# Altium project 2011 Tilt Sensor.PrjPcb
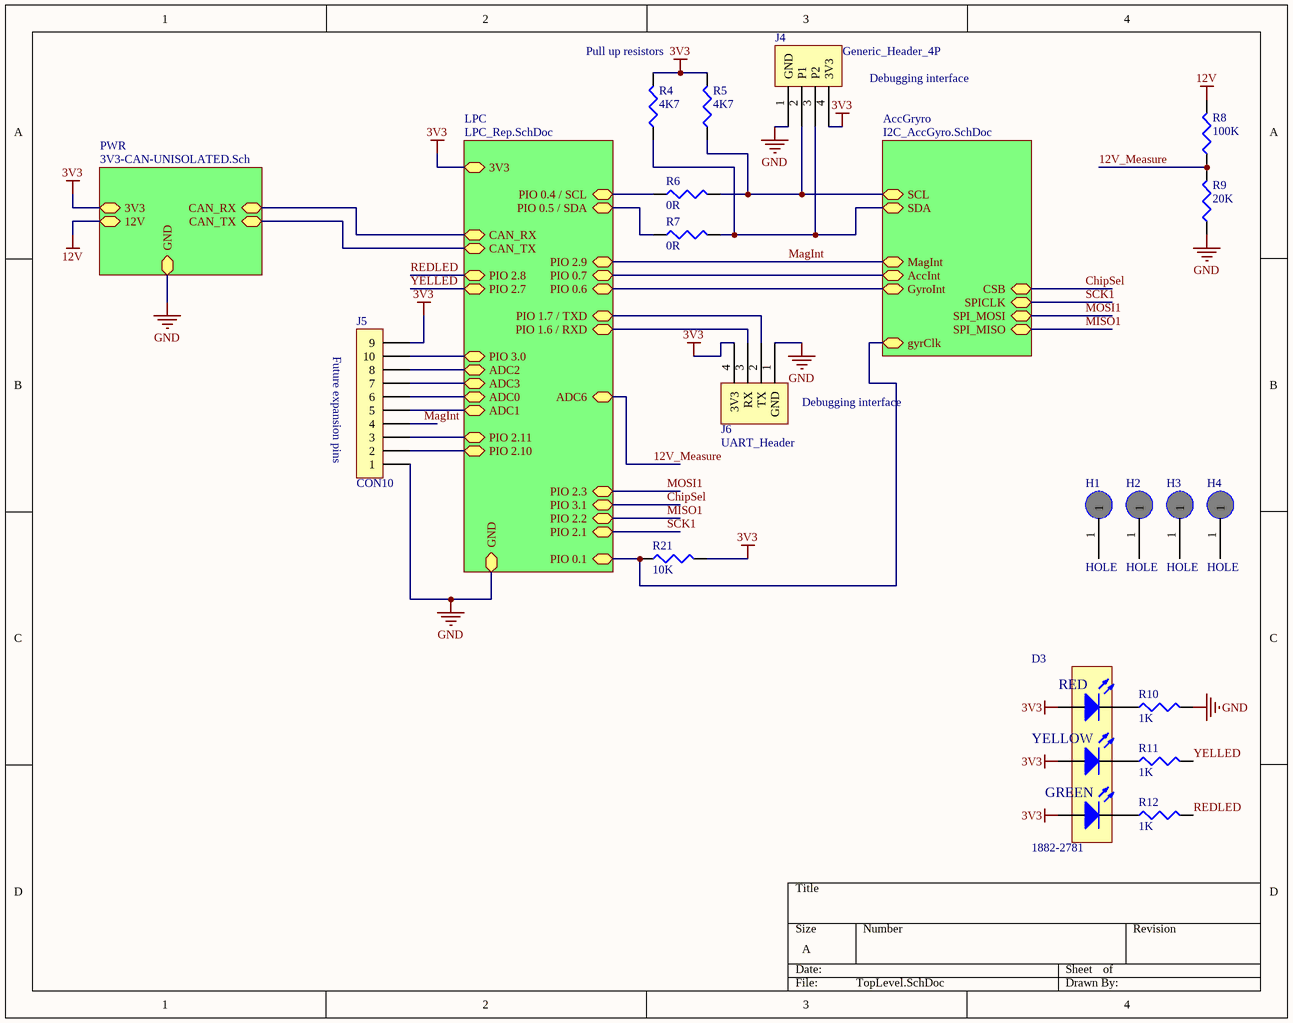
[diagram p0: TopLevel.SchDoc]
2 sheets, 49 parts. Net scope: hierarchical (ports join the sheet entries above them; power ports are global).
Board file: TiltPCB_1.PcbDoc
Sheets:
  TopLevel.SchDoc
    AccGryro = I2C_AccGyro.SchDoc

## Sheet TopLevel.SchDoc
size A

### Parts
D3  1882-2781  [LED_TRILEVEL]
H1  HOLE  [M2.5]
H2  HOLE  [M2.5]
H3  HOLE  [M2.5]
H4  HOLE  [M2.5]
J4  Generic_Header_4P  [IDC4]
J5  CON10  [IDC10]
J6  UART_Header  [IDC4]
R4  4K7  [0603]
R5  4K7  [0603]
R6  0R  [0603]
R7  0R  [0603]
R8  100K  [0603]
R9  20K  [0603]
R10  1K  [0603]
R11  1K  [0603]
R12  1K  [0603]
R21  10K  [0603]

### Sub-sheets
AccGryro = I2C_AccGyro.SchDoc: SCL (bidir), SDA (bidir), AccInt (bidir), GyroInt (bidir), MagInt (bidir), SPI_MISO (bidir), SPI_MOSI (bidir), CSB (bidir), SPICLK (bidir), gyrClk (bidir)
LPC = LPC_Rep.SchDoc (file not in this document): PIO 0.4 / SCL (bidir), PIO 0.5 / SDA (bidir), GND (bidir), 3V3 (bidir), CAN_RX (bidir), CAN_TX (bidir), PIO 1.6 / RXD (bidir), PIO 1.7 / TXD (bidir), ADC6 (bidir), PIO 0.7 (bidir), PIO 2.9 (bidir), PIO 2.8 (bidir), PIO 2.7 (bidir), PIO 0.6 (bidir), PIO 3.0 (bidir), ADC3 (bidir), ADC2 (bidir), ADC1 (bidir), ADC0 (bidir), PIO 2.11 (bidir), PIO 2.10 (bidir), PIO 2.3 (bidir), PIO 3.1 (bidir), PIO 2.2 (bidir), PIO 2.1 (bidir), PIO 0.1 (bidir)
PWR = 3V3-CAN-UNISOLATED.Sch (file not in this document): CAN_RX (bidir), CAN_TX (bidir), 3V3 (bidir), 12V (bidir), GND (bidir)

### Nets
3V3: D3.4(A) D3.5(A) D3.6(A) J4.4(3V3) J5.9 J6.4(3V3) R4.2 R5.2 R21.2 ; sheet LPC/3V3, sheet PWR/3V3
12V: R8.2 ; sheet PWR/12V
GND: J4.1(GND) J5.1 J6.1(GND) R9.1 R10.2 ; sheet LPC/GND, sheet PWR/GND
12V_Measure: R8.1 R9.2 ; sheet LPC/ADC6
ChipSel: sheet LPC/PIO 3.1, sheet AccGryro/CSB
I2C_SCL: J4.2(P1) R5.1 R6.2 ; sheet AccGryro/SCL
I2C_SDA: J4.3(P2) R4.1 R7.2 ; sheet AccGryro/SDA
MagInt: J5.4 ; sheet LPC/PIO 2.9, sheet AccGryro/MagInt
MISO1: sheet LPC/PIO 2.2, sheet AccGryro/SPI_MISO
MOSI1: sheet LPC/PIO 2.3, sheet AccGryro/SPI_MOSI
REDLED: R12.2 ; sheet LPC/PIO 2.8
SCK1: sheet LPC/PIO 2.1, sheet AccGryro/SPICLK
YELLED: R11.2 ; sheet LPC/PIO 2.7
NetD3_1: D3.1(K) R12.1
NetD3_2: D3.2(K) R11.1
NetD3_3: D3.3(K) R10.1
NetJ5_2: J5.2 ; sheet LPC/PIO 2.10
NetJ5_3: J5.3 ; sheet LPC/PIO 2.11
NetJ5_5: J5.5 ; sheet LPC/ADC1
NetJ5_6: J5.6 ; sheet LPC/ADC0
NetJ5_7: J5.7 ; sheet LPC/ADC3
NetJ5_8: J5.8 ; sheet LPC/ADC2
NetJ5_10: J5.10 ; sheet LPC/PIO 3.0
NetJ6_2: J6.2(TX) ; sheet LPC/PIO 1.7 / TXD
NetJ6_3: J6.3(RX) ; sheet LPC/PIO 1.6 / RXD
NetR6_1: R6.1 ; sheet LPC/PIO 0.4 / SCL
NetR7_1: R7.1 ; sheet LPC/PIO 0.5 / SDA
NetR21_1: R21.1 ; sheet LPC/PIO 0.1, sheet AccGryro/gyrClk
NetU4_4: sheet LPC/PIO 0.7, sheet AccGryro/AccInt
NetU5_12: sheet LPC/PIO 0.6, sheet AccGryro/GyroInt
(unnamed): sheet LPC/CAN_RX, sheet PWR/CAN_RX
(unnamed): sheet LPC/CAN_TX, sheet PWR/CAN_TX

Not connected (* = marked no-connect by the designer): H1 1; H2 1; H3 1; H4 1

### Notes on the sheet
- Pull up resistors
- (near J4) Debugging interface
- (near J5) Future expansion pins
- (near J6) Debugging interface
- (in symbol LED-TRILEVEL) RED; YELLOW; GREEN

### Library data of the parts
D3 = LED-TRILEVEL: Three level LED; Needed?: Farnell - Low Stock; Farnell: 1461596; Farnell Price: 4.56
H1-H4 = HOLE: Needed?: NO - Footprint
J4 = Generic_Header_4P: Needed?: NO - Common
J5 = CON10: 10 pin, right angle, ribbon con with claws; Needed?: NO - Common; Farnell Price: 5.46
J6 = UART_Header: Needed?: NO - Common
R4 R5 = RES1: Resistor; Value: 4.7k; Needed?: NO - HW LAB
R6-R12 R21 = RES1: Resistor; Needed?: NO - HW LAB
  R6 R7: Value: 0R
  R8: Value: 100k
  R9: Value: 20k
  R10-R12: Value: 1k
  R21: Value: 10k

## Sheet I2C_AccGyro.SchDoc
size A
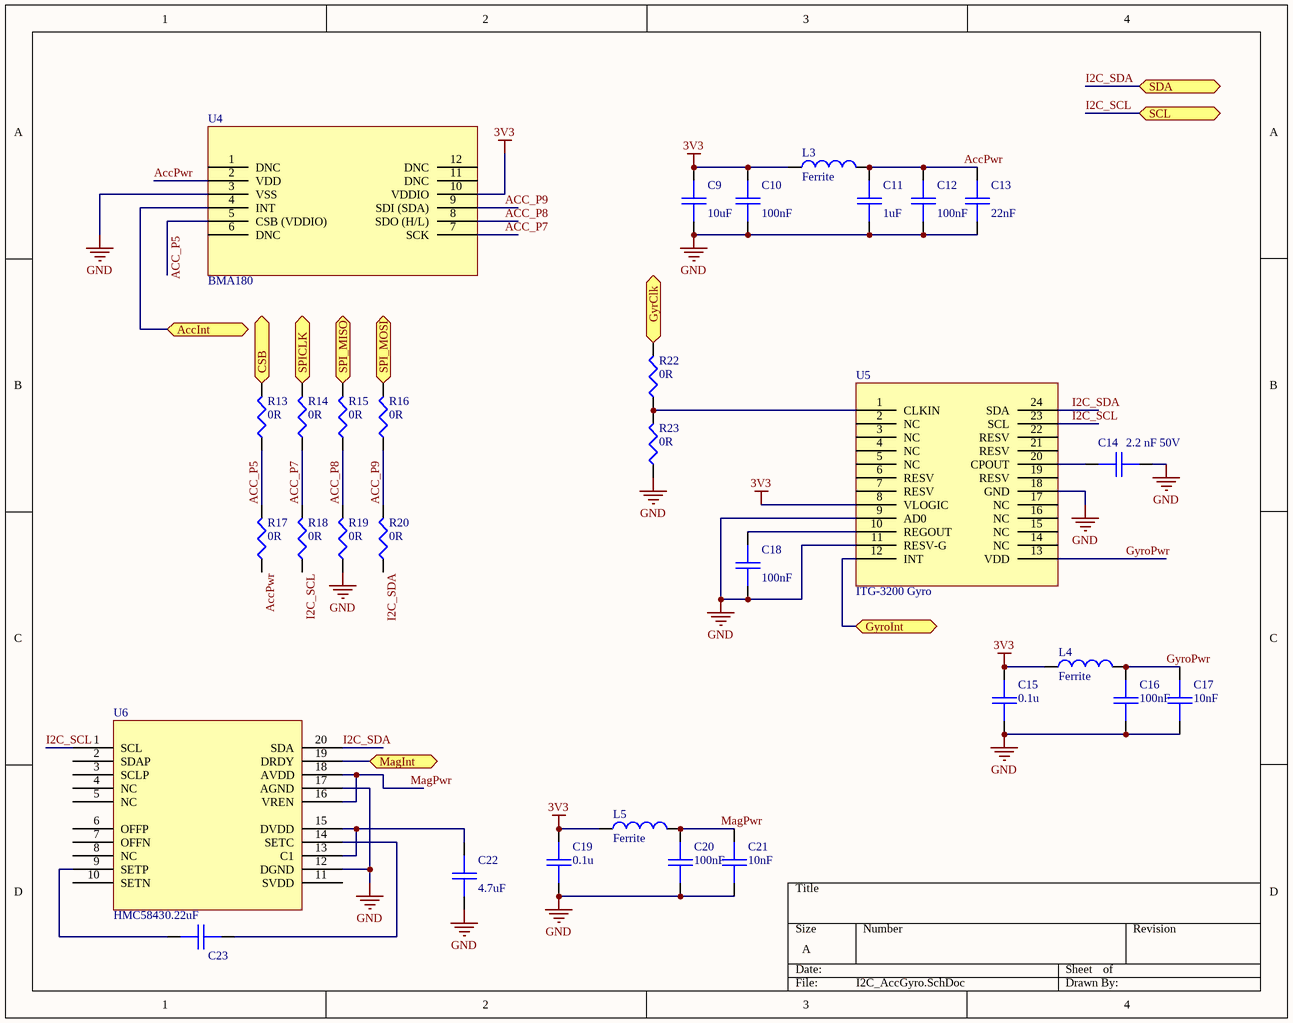
[diagram p1: I2C_AccGyro.SchDoc]

### Parts
C9  value 10uF  [0603]  (hidden comment: 10u)
C10  value 100nF  [0603]  (hidden comment: 0.1u)
C11  value 1uF  [0603]  (hidden comment: 1u)
C12  100nF  [0603]
C13  22nF  [0603]
C14  value 2.2 nF 50V  [0603]  (hidden comment: 2.2n 50V)
C15  0.1u  [0603]
C16  100nF  [0603]
C17  10nF  [0603]
C18  value 100nF  [0603]  (hidden comment: 100n)
C19  0.1u  [0603]
C20  100nF  [0603]
C21  10nF  [0603]
C22  value 4.7uF  [0603]  (hidden comment: 4.7u)
C23  value 0.22uF  [0603]  (hidden comment: 0.22u)
L3  Ferrite  [0603]
L4  Ferrite  [0603]
L5  Ferrite  [0603]
R13  0R  [0603]
R14  0R  [0603]
R15  0R  [0603]
R16  0R  [0603]
R17  0R  [0603]
R18  0R  [0603]
R19  0R  [0603]
R20  0R  [0603]
R22  0R  [0603]
R23  0R  [0603]
U4  BMA180  [LGA - BMA180]
U5  ITG-3200 Gyro  [ITG-3200 - QFN 24 Pin]
U6  HMC5843  [HMC5843 - LPCC 20 Pin]

### Ports
AccInt, CSB (in), GyrClk (in), GyroInt, MagInt, SCL, SDA, SPI_MISO, SPI_MOSI, SPICLK

### Nets
3V3: C9.1 C10.1 C15.1 C19.1 L3.1 L4.1 L5.1 U4.10(VDDIO) U5.8(VLOGIC)
GND: C9.2 C10.2 C11.2 C12.2 C13.2 C14.2 C15.2 C16.2 C17.2 C18.2 C19.2 C20.2 C21.2 C22.2 R19.1 R23.1 U4.3(VSS) U5.9(AD0) U5.11(RESV-G) U5.18(GND) U6.12(DGND) U6.17(AGND)
ACC_P5: R13.1 R17.2 U4.5(CSB_(VDDIO))
ACC_P7: R14.1 R18.2 U4.7(SCK)
ACC_P8: R15.1 R19.2 U4.8(SDO_(H/L))
ACC_P9: R16.1 R20.2 U4.9(SDI_(SDA))
AccPwr: C11.1 C12.1 C13.1 L3.2 R17.1 U4.2(VDD)
ChipSel: R13.2 ; port CSB
GyroPwr: C16.1 C17.1 L4.2 U5.13(VDD)
I2C_SCL: R18.1 U5.23(SCL) U6.1(SCL) ; port SCL
I2C_SDA: R20.1 U5.24(SDA) U6.20(SDA) ; port SDA
MagInt: U6.19(DRDY) ; port MagInt
MagPwr: C20.1 C21.1 L5.2 U6.16(VREN) U6.18(AVDD)
MISO1: R15.2 ; port SPI_MISO
MOSI1: R16.2 ; port SPI_MOSI
SCK1: R14.2 ; port SPICLK
NetC14_1: C14.1 U5.20(CPOUT)
NetC18_1: C18.1 U5.10(REGOUT)
NetC22_1: C22.1 U6.13(C1) U6.15(DVDD)
NetC23_1: C23.1 U6.14(SETC)
NetC23_2: C23.2 U6.9(SETP)
NetR21_1: R22.2 ; port GyrClk
NetR22_1: R22.1 R23.2 U5.1(CLKIN)
NetU4_4: U4.4(INT) ; port AccInt
NetU5_12: U5.12(INT) ; port GyroInt

Not connected (* = marked no-connect by the designer): U4 1(DNC) 6(DNC) 11(DNC) 12(DNC); U5 2(NC) 3(NC) 4(NC) 5(NC) 6(RESV) 7(RESV) 14(NC) 15(NC) 16(NC) 17(NC) 19(RESV) 21(RESV) 22(RESV); U6 2(SDAP) 3(SCLP) 4(NC) 5(NC) 6(OFFP) 7(OFFN) 8(NC) 10(SETN) 11(SVDD)

### Library data of the parts
C9 C11 C13 C14 C22 C23 = CAP: Capacitor; Needed?: Yes - See Spreadsheet
  C13: Value: 22nF
  C14 C22 C23: Revision: July-2002: Re-released for DXP Platform.
C10 C12 C16-C18 C20 C21 = CAP: Capacitor; Needed?: NO - HW LAB
  C12 C16 C20: Value: 100nF
  C17 C21: Value: 10nF
  C18: Revision: July-2002: Re-released for DXP Platform.
C15 C19 = CAP: Capacitor; Value: 100nF; Needed?: NO - HW LAB
L3-L5 = INDUCTOR: Manufacturer: Generic Components; Needed?: Yes - See Spreadsheet; Published: 8-Jun-2000; Revision: July-2002: Re-released for DXP Platform.; Publisher: Altium Limited
R13-R20 R22 R23 = RES1: Resistor; Needed?: NO - HW LAB; Value: 0R
U4 = BMA180: Needed?: Special
U5 = ITG-3200: Needed?: Special
U6 = HMC5843: Needed?: Special

## Nets that join several sheets
3V3: TopLevel (9 pins), I2C_AccGyro (9 pins)
GND: TopLevel (5 pins), I2C_AccGyro (22 pins)
I2C_SCL: TopLevel (J4.2 R5.1 R6.2), I2C_AccGyro (R18.1 U5.23 U6.1)
I2C_SDA: TopLevel (J4.3 R4.1 R7.2), I2C_AccGyro (R20.1 U5.24 U6.20)
MagInt: TopLevel (J5.4), I2C_AccGyro (U6.19)
NetR21_1: TopLevel (R21.1), I2C_AccGyro (R22.2)